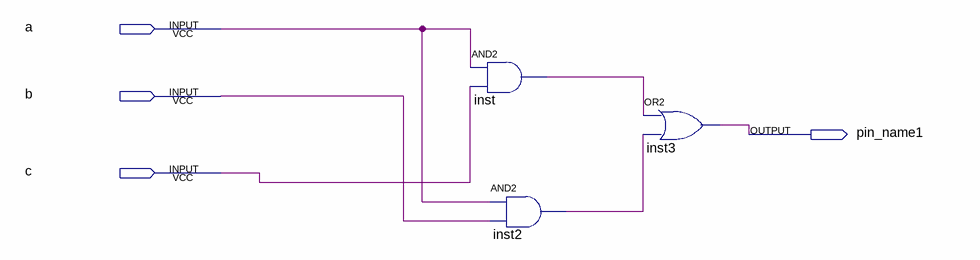
[diagram p0: schematic sheet]
// Quartus schematic decod1-7.bdf as structural Verilog: 3 symbols, 4 pins
module \decod1-7  (
  input  a,
  input  b,
  input  c,
  output pin_name1
);

  wire inst2_out, inst_out;

  and inst (inst_out, a, c);
  and inst2 (inst2_out, a, b);
  or inst3 (pin_name1, inst_out, inst2_out);
endmodule
